# EAGLE design controller-main_2 (EAGLE 8.4.1)
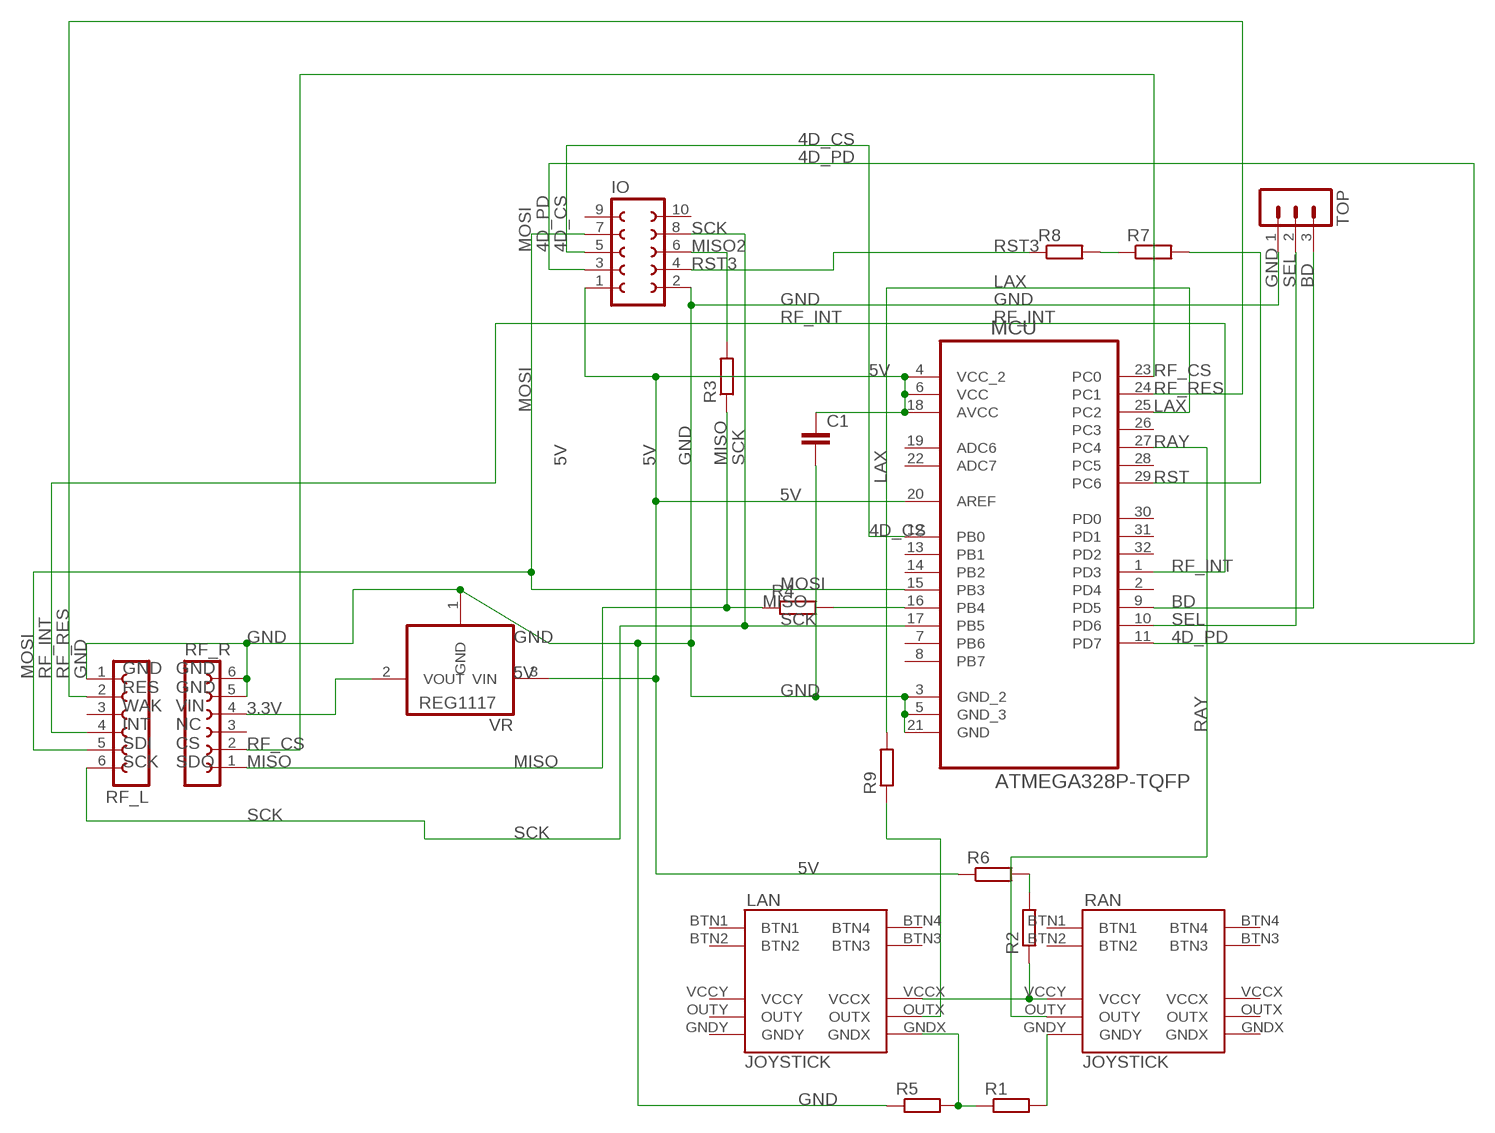
[diagram p0: schematic, sheet 1]

## Parts
C1  C-EUC1206  [C1206]
IO  FE05-2W  [FE05-2W]
LAN  JOYSTICK  JOYSTICKJOYSTICKWBTN  [JOYSTICK]
MCU  ATMEGA328P-TQFP  ATMEGA328P-AU  [QFP80P900X900X120-32N]
R1  R-EU_M1206  [M1206]
R2  R-EU_M1206  [M1206]
R3  R-EU_M1206  [M1206]
R4  R-EU_M1206  [M1206]
R5  R-EU_M1206  [M1206]
R6  R-EU_M1206  [M1206]
R7  R-EU_M1206  [M1206]
R8  R-EU_M1206  [M1206]
R9  R-EU_M1206  [M1206]
RAN  JOYSTICK  JOYSTICKJOYSTICKWBTN  [JOYSTICK]
RF_L  FE06-1  [FE06]
RF_R  FE06-1  [FE06]
TOP  MA03-1  [MA03-1]
VR  REG1117  [SOT223]

## Nets
3.3V: RF_R.4 VR.2(VOUT)
4D_CS: IO.5 MCU.12(PB0)
4D_PD: IO.3 MCU.11(PD7)
5V: C1.1 IO.1 MCU.4(VCC_2) MCU.6(VCC) MCU.18(AVCC) MCU.20(AREF) R6.1 VR.3(VIN)
5V2: R2.2 R6.2
5V_R: LAN.VCCX R2.1 RAN.VCCY
BD: MCU.9(PD5) TOP.3
GND: C1.2 IO.2 MCU.3(GND_2) MCU.5(GND_3) MCU.21(GND) R5.1 RF_L.1 RF_R.5 RF_R.6 TOP.1 VR.1(GND)
GND2: LAN.GNDX R1.1 R5.2
LAX: MCU.25(PC2) R9.2
LAX2: LAN.OUTX R9.1
MISO: R3.1 R4.1 RF_R.1
MISO2: IO.6 R3.2
MISO3: MCU.16(PB4) R4.2
MOSI: IO.7 MCU.15(PB3) RF_L.5
N$1: R1.2 RAN.GNDY
RAY: MCU.27(PC4) RAN.OUTY
RF_CS: MCU.23(PC0) RF_R.2
RF_INT: MCU.1(PD3) RF_L.4
RF_RES: MCU.24(PC1) RF_L.2
RST: MCU.29(PC6) R7.2
RST2: R7.1 R8.2
RST3: IO.4 R8.1
SCK: IO.8 MCU.17(PB5) RF_L.6
SEL: MCU.10(PD6) TOP.2
Unconnected: IO.9 IO.10 LAN.BTN1 LAN.BTN2 LAN.BTN3 LAN.BTN4 LAN.GNDY LAN.OUTY LAN.VCCY MCU.2(PD4) MCU.7(PB6) MCU.8(PB7) MCU.13(PB1) MCU.14(PB2) MCU.19(ADC6) MCU.22(ADC7) MCU.26(PC3) MCU.28(PC5) MCU.30(PD0) MCU.31(PD1) MCU.32(PD2) RAN.BTN1 RAN.BTN2 RAN.BTN3 RAN.BTN4 RAN.GNDX RAN.OUTX RAN.VCCX RF_L.3 RF_R.3

## Notes on the sheet
- GND
  RES
  WAK
  INT
  SDI
  SCK
- GND
  GND
  VIN
  NC
  CS
  SDO

## Library data of the parts
C1 = resistor:C-EU: CAPACITOR, European symbol
IO = con-lsta:FE05-2W: FEMALE HEADER; OC_FARNELL: unknown; OC_NEWARK: unknown
LAN RAN = joystick:JOYSTICK
MCU = Atmel_By_element14_Batch_1-00:ATMEGA328P-AU: 8-bit Microcontroller with In-System Programmable Flash; MPN: ATMEGA328P-AU; OC_FARNELL: 1715486; OC_NEWARK: 14R4631; PACKAGE: TQFP-32; SUPPLIER: Atmel
R1-R9 = resistor:R-EU_: RESISTOR, European symbol
RF_L RF_R = con-lsta:FE06-1: FEMALE HEADER; OC_FARNELL: unknown; OC_NEWARK: unknown
TOP = con-lstb:MA03-1: PIN HEADER; OC_FARNELL: unknown; OC_NEWARK: unknown
VR = burr-brown:REG1117: 800mA and 1A Low Dropout (LDO) Positive Regulator 1.8V, 2.5V, 2.85V, 3.3V, 5V, and Adj; MPN: REG1117; OC_FARNELL: 1097566; OC_NEWARK: 14P6981

## Board
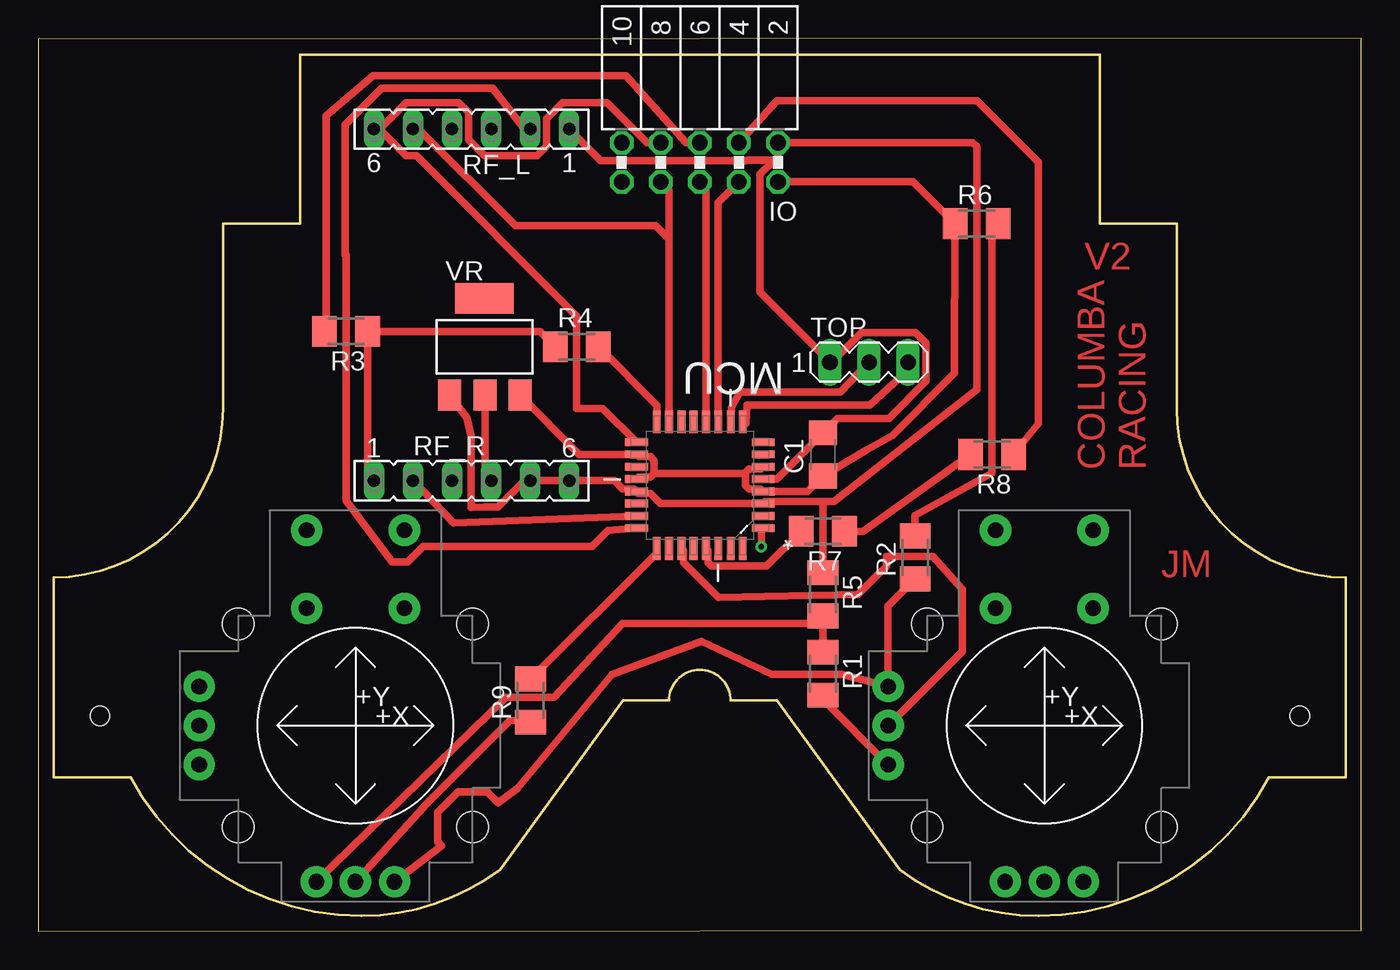
[diagram p1: board, top side]
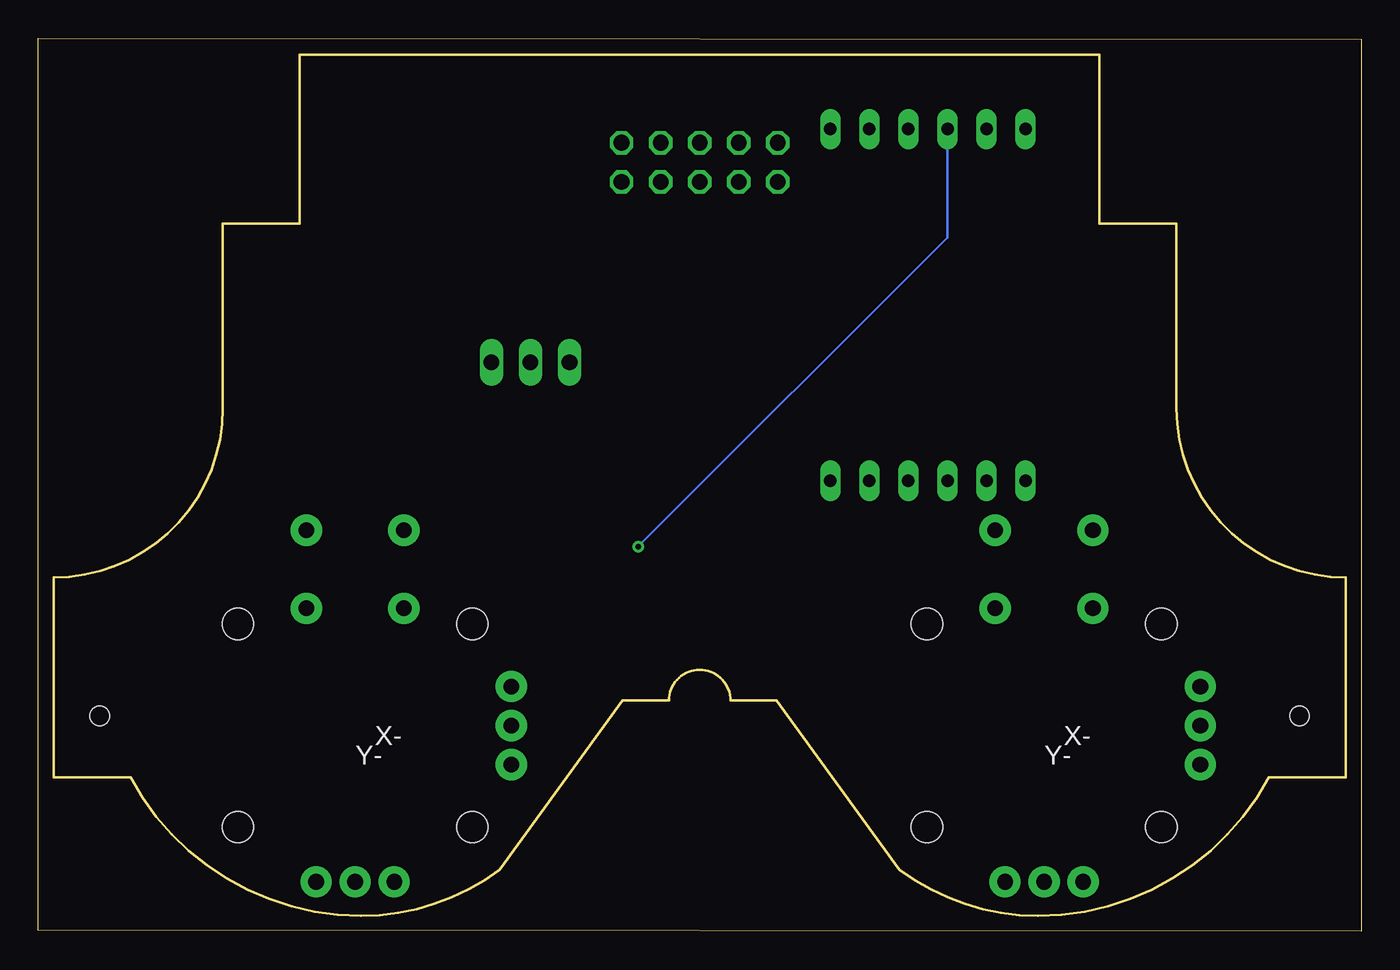
[diagram p2: board, bottom side, seen from below]

Size 85.99 x 58.05 mm. Coordinates in mm from the lower left corner, seen from the top.
Outline: 0,0 85.99,0.05 85.99,58.05 0,58 0,0
Outline: 17,57 69,57 69,46 74,46 74,34 arc90 85,23 85,10 80,10 arc-62 65,1 arc-37 56,4 48,15 45,15 arc90 43,17 arc90 41,15 38,15 30,4 arc-37 21,1 arc-62 6,10 1,10 1,23 arc90 12,34 12,46 17,46 17,57
Copper layers (1*16): Top 0.035mm / dielectric 1.5mm / Bottom 0.035mm
Design rules "default": minimum track width 6mil, minimum drill 0.35mm, track to track 6mil, track to pad 6mil, pad to pad 6mil, via to via 6mil, smd to smd 6mil, copper to edge 40mil, drill to drill 6mil, minimum pad ring 10mil, minimum via ring 8mil, stop-mask expansion 4mil, vias tented up to drill 0mil, thermal gap 10mil
Holes 1.25 mm at 4,14 82,14

### Footprints (pad centres in the part's own frame; a part is rotated, then mirrored left to right if it is on the bottom)
C1206 = smd 1.6 x 1.8: 1 -1.4,0; 2 1.4,0
FE05-2W = drill 1.016 octagon: 1 -5.08,1.27; 2 -5.08,-1.27; 3 -2.54,1.27; 4 -2.54,-1.27; 5 0,1.27; 6 0,-1.27; 7 2.54,1.27; 8 2.54,-1.27; 9 5.08,1.27; 10 5.08,-1.27
JOYSTICK = drill 1.016 pad 2.032: BTN1 -3.175,12.7; BTN2 -3.175,7.62; BTN3 3.175,7.62; BTN4 3.175,12.7; GNDX -2.54,-10.16; GNDY -10.16,-2.54; OUTX 0,-10.16; OUTY -10.16,0; VCCX 2.54,-10.16; VCCY -10.16,2.54 | hole 2.032: -7.62,6.604; -7.62,-6.604; 7.62,6.604; 7.62,-6.604
QFP80P900X900X120-32N = smd 1.473 x 0.508: 1 -4.115,2.794; 2 -4.115,2.007; 3 -4.115,1.194; 4 -4.115,0.406; 5 -4.115,-0.406; 6 -4.115,-1.194; 7 -4.115,-2.007; 8 -4.115,-2.794; 17 4.115,-2.794; 18 4.115,-2.007; 19 4.115,-1.194; 20 4.115,-0.406; 21 4.115,0.406; 22 4.115,1.194; 23 4.115,2.007; 24 4.115,2.794 | smd 0.508 x 1.473: 9 -2.794,-4.115; 10 -2.007,-4.115; 11 -1.194,-4.115; 12 -0.406,-4.115; 13 0.406,-4.115; 14 1.194,-4.115; 15 2.007,-4.115; 16 2.794,-4.115; 25 2.794,4.115; 26 2.007,4.115; 27 1.194,4.115; 28 0.406,4.115; 29 -0.406,4.115; 30 -1.194,4.115; 31 -2.007,4.115; 32 -2.794,4.115
M1206 = smd 1.6 x 2: 1 -1.4,0; 2 1.4,0
FE06 = drill 0.813 long: 1 -6.35,0; 2 -3.81,0; 3 -1.27,0; 4 1.27,0; 5 3.81,0; 6 6.35,0
MA03-1 = drill 1.016 long: 1 -2.54,0; 2 0,0; 3 2.54,0
SOT223 = smd 1.499 x 2.007: 1 -2.261,-3.15; 2 0.025,-3.15; 3 2.311,-3.15 | smd 3.81 x 2.007: 4 0,3.15

### Placement (x,y rotation side)
C1  51,31 90 top
IO  43,50 180 top
LAN  20.61,13.37 0 top
MCU  43,29 180 top
R1  51,16.75 270 top
R2  57,24.3 90 top
R3  20,39 180 top
R4  35,38 0 top
R5  51,21.9 270 top
R6  61,46 0 top
R7  51,26 180 top
R8  62,31 180 top
R9  32,15 90 top
RAN  65.4,13.37 0 top
RF_L  28.16,52.15 180 top
RF_R  28.16,29.29 0 top
TOP  54,37 0 top
VR  29,38 0 top

### Tracks (layer width: path | path; a pad name or v marks a point on that pad's centre or on a via)
3.3V
  Top 0.5: RF_R.4 29.02,29.7 VR.2
4D_CS
  Top 0.5: MCU.12 43.41,48.32 IO.5
4D_PD
  Top 0.5: MCU.11 44.19,47.38 IO.3
5V
  Top 0.5: VR.3 35.16,31.01 MCU.18 39.04,30.85 39.79,30.85 40.02,30.61 40.02,29.77 | 45.98,29.83 46.21,30.06 46.98,30.06 MCU.6 | 45.98,29.83 45.98,28.99 46.21,28.75 46.96,28.75 MCU.4 49.99,28.59 C1.1 53.84,31.3 55.52,32.24 59.55,36.28 R6.1 56.87,48.73 IO.1 | 40.02,29.77 39.79,29.54 39.02,29.54 MCU.20 | 40.02,29.77 45.92,29.77 45.98,29.83
5V2
  Top 0.5: R2.2 57,27.03 62,29.78 62,45.35 R6.2
5V_R
  Top 0.5: LAN.VCCX 26.22,5.55 25.95,5.82 25.95,7.71 27.29,9.05 29.18,9.05 29.89,8.34 31.15,9.3 37.3,16.7 43.1,18.85 47.7,16.7 52.25,16.7 RAN.VCCY 55.24,21.14 R2.1
BD
  Top 0.5: TOP.3 56,37 56,36 54.05,34.2 46.05,34.2 46,33 MCU.9
GND
  Top 0.5: VR.1 27.87,33.37 27.87,33.33 28.12,32.19 28.12,27.54 28.99,27.57 29.87,27.57 31.59,29.29 RF_R.5 RF_R.6 37.44,29.29 37.98,28.75 38.73,28.75 MCU.21 39.02,28.46 39.79,28.46 40.45,27.81 MCU.3 47.25,27.94 51,27.94 | MCU.5 48.01,29.41 C1.2 51.95,33.35 55.3,33.35 57.7,35.76 57.7,38.24 57.02,38.93 53.52,38.93 51.59,37 TOP.1 46.92,41.54 46.92,49.21 47.85,50.15 | 61.01,39 61.01,35.22 51.73,27.94 51,27.94 | 61.01,39 61.01,39.45 | 47.85,50.15 48.08,50.38 IO.2 60.73,51.27 61,51 61,39.01 61.01,39 | 47.85,50.15 46.06,50.15 46.02,50.11 36.55,50.11 RF_L.1 | 51,27.94 R5.1
GND2
  Top 0.5: 51,20 R5.2 | 51,20 R1.1 | LAN.GNDX 30.41,15.2 33.52,15.2 37.97,20 51,20
LAX
  Top 0.5: R9.2 40.21,24.61 MCU.25
LAX2
  Top 0.5: LAN.OUTX 25.05,8.05 25.05,8.08 30.66,13.7 R9.1
MISO
  Top 0.5: RF_R.1 21.4,29.7 R3.1 32.6,39 R4.1
MISO2
  Top 0.5: R3.2 18.7,40 18.7,53.02 21.75,55.63 38.2,55.63 42.11,51.27 IO.6
MISO3
  Top 0.5: R4.2 40.21,34.19 MCU.16
MOSI
  Top 0.5: 40.99,45 40.99,48.2 IO.7 | 40.99,45 MCU.15 | RF_L.5 24.73,52.15 31.01,45.87 40.13,45.87 40.99,45
N$1
  Top 0.5: R1.2 51,15.07 RAN.GNDY
RAY
  Top 0.5: MCU.27 41.94,24.75 41.94,23.98 44.22,21.7 53.29,21.9 54.57,23.18 55.15,23.7 55.15,24.37 55.83,24.35 58.17,24.35 60.06,22.21 60.06,18.18 55.24,13.35 RAN.OUTY
RF_CS
  Top 0.5: RF_R.2 27,26.55 MCU.23
RF_INT  (via drill 0.35)
  Top 0.5: v47,25 47,26.09 MCU.1
  Bottom 0.152: RF_L.4 26.89,45.11 v47,25
RF_RES
  Top 0.5: RF_L.2 31.59,52.15 29.52,54.83 22.32,54.83 19.95,52.45 19.95,43.95 20,44 20,28 23,24 24,24 25,25 36,25 37.04,26.04 MCU.24
RST
  Top 0.5: MCU.29 43.54,24.75 43.54,23.98 43.77,23.75 47.35,23.75 R7.2
RST2
  Top 0.5: R7.1 53.6,26 R8.2
RST3
  Top 0.5: IO.4 48,54 61,54 65,50 65,33 R8.1
SCK
  Top 0.5: IO.8 39.57,51.27 36.96,53.87 34.07,53.87 33.03,52.84 33.03,51.05 32.41,50.43 28.99,50.43 27.95,51.46 27.95,53.25 27.33,53.87 23.91,53.87 22.19,52.15 | RF_L.6 22.19,52.15 | 22.19,52.15 23.91,50.43 24.57,50.43 35,40 35,34 36.68,34 MCU.17
SEL
  Top 0.5: TOP.2 52.15,35.05 45.6,35.05 45.05,34.05 45,33 MCU.10

### Text on the board
Top: V2 | COLUMBA / RACING | JM